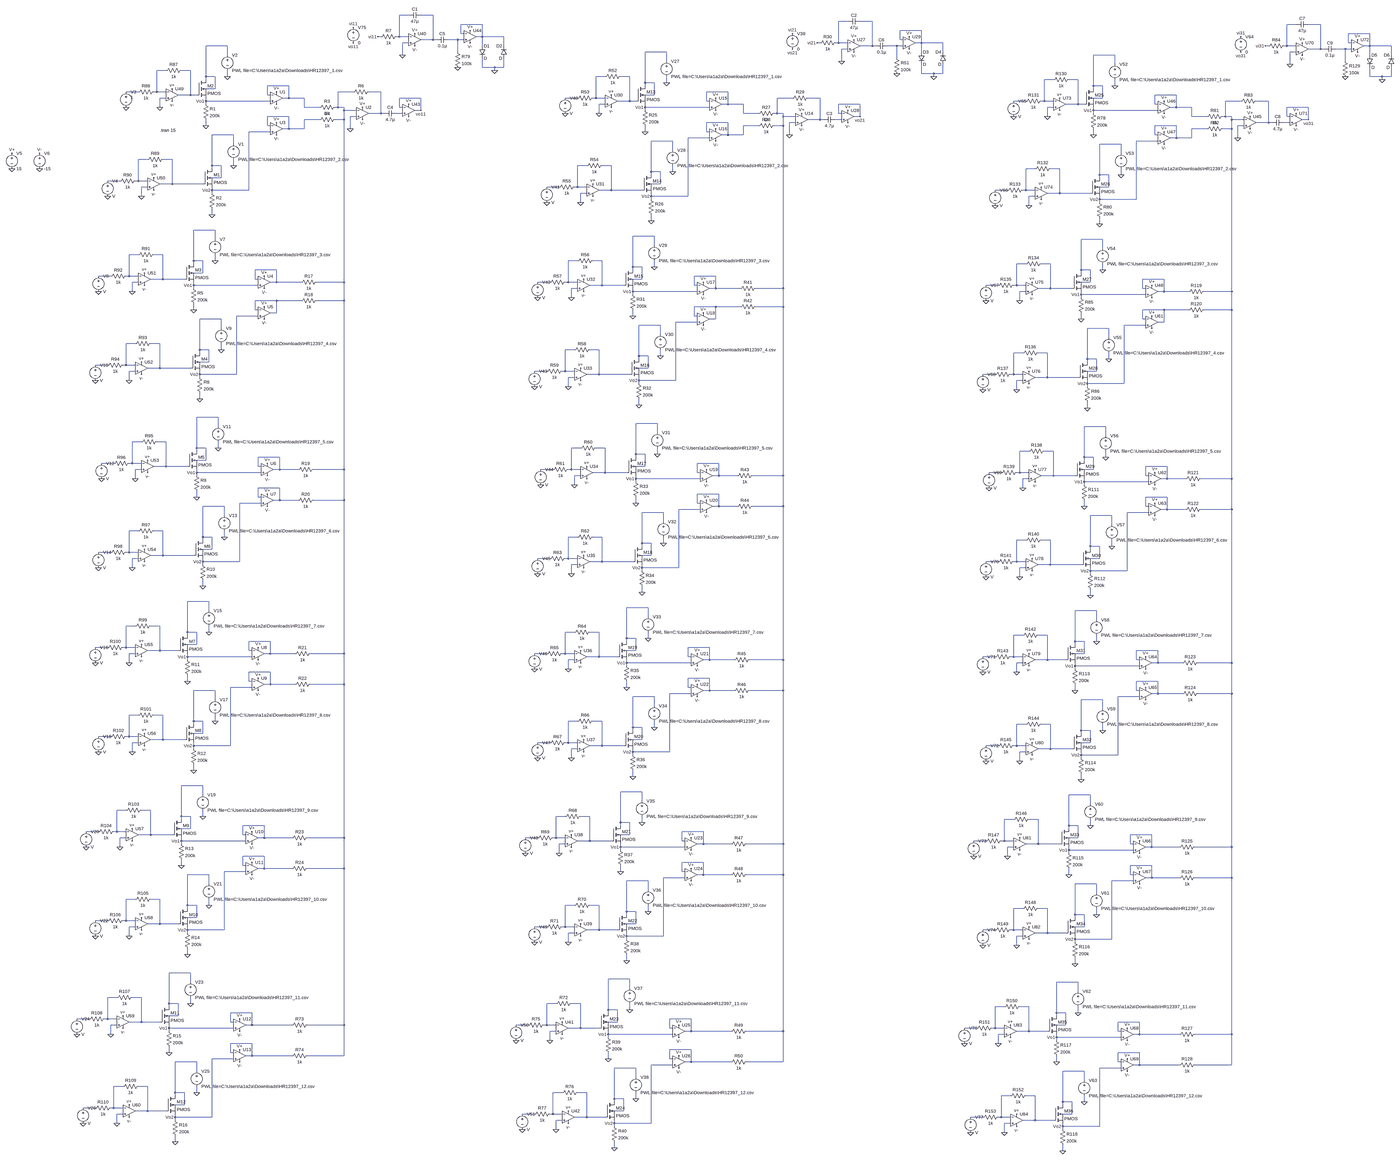
[diagram p0: schematic MASS_Journal_ext_12i3o_36weights_DP.asc, whole sheet]
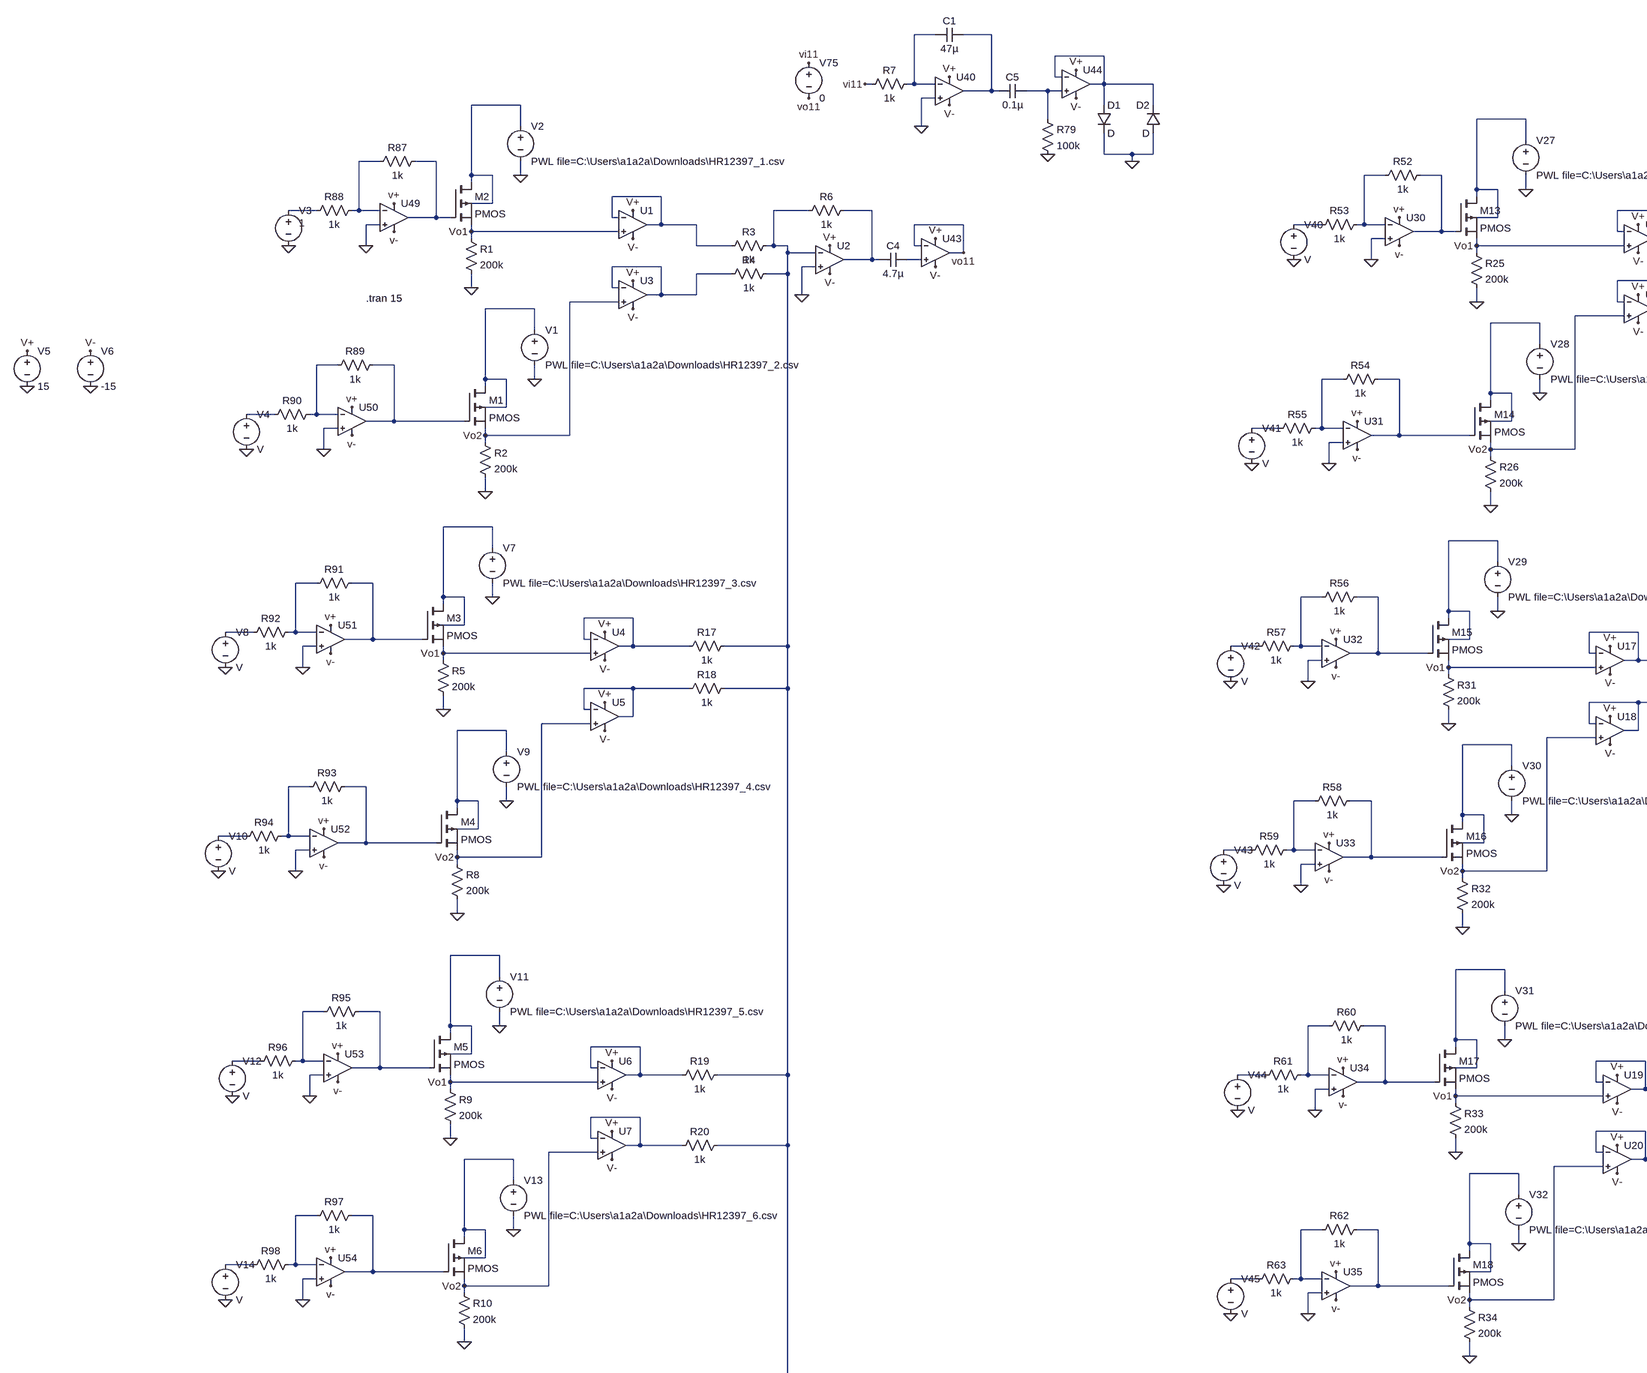
[diagram p1: schematic MASS_Journal_ext_12i3o_36weights_DP.asc, part, row 1 of 2, column 1 of 2]
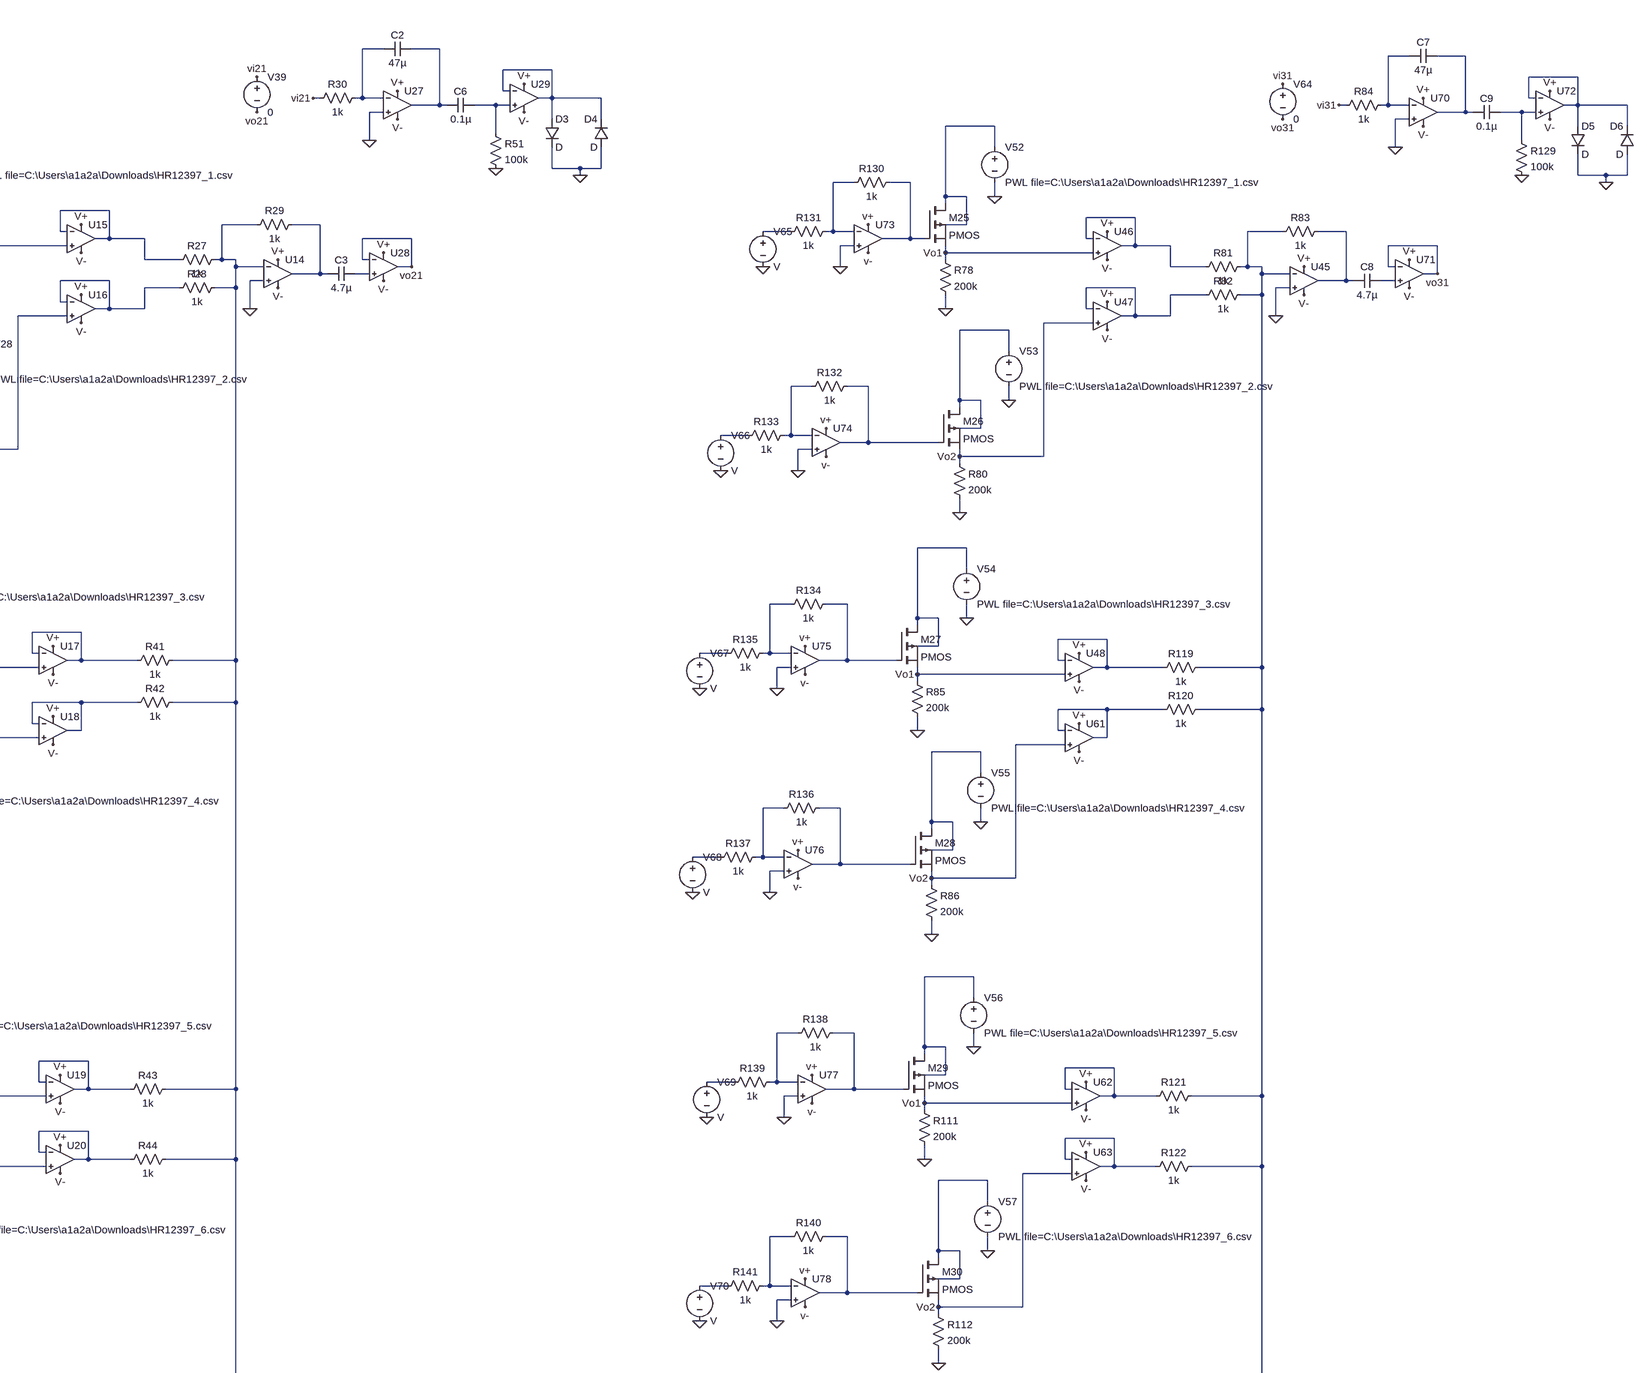
[diagram p2: schematic MASS_Journal_ext_12i3o_36weights_DP.asc, part, row 1 of 2, column 2 of 2]
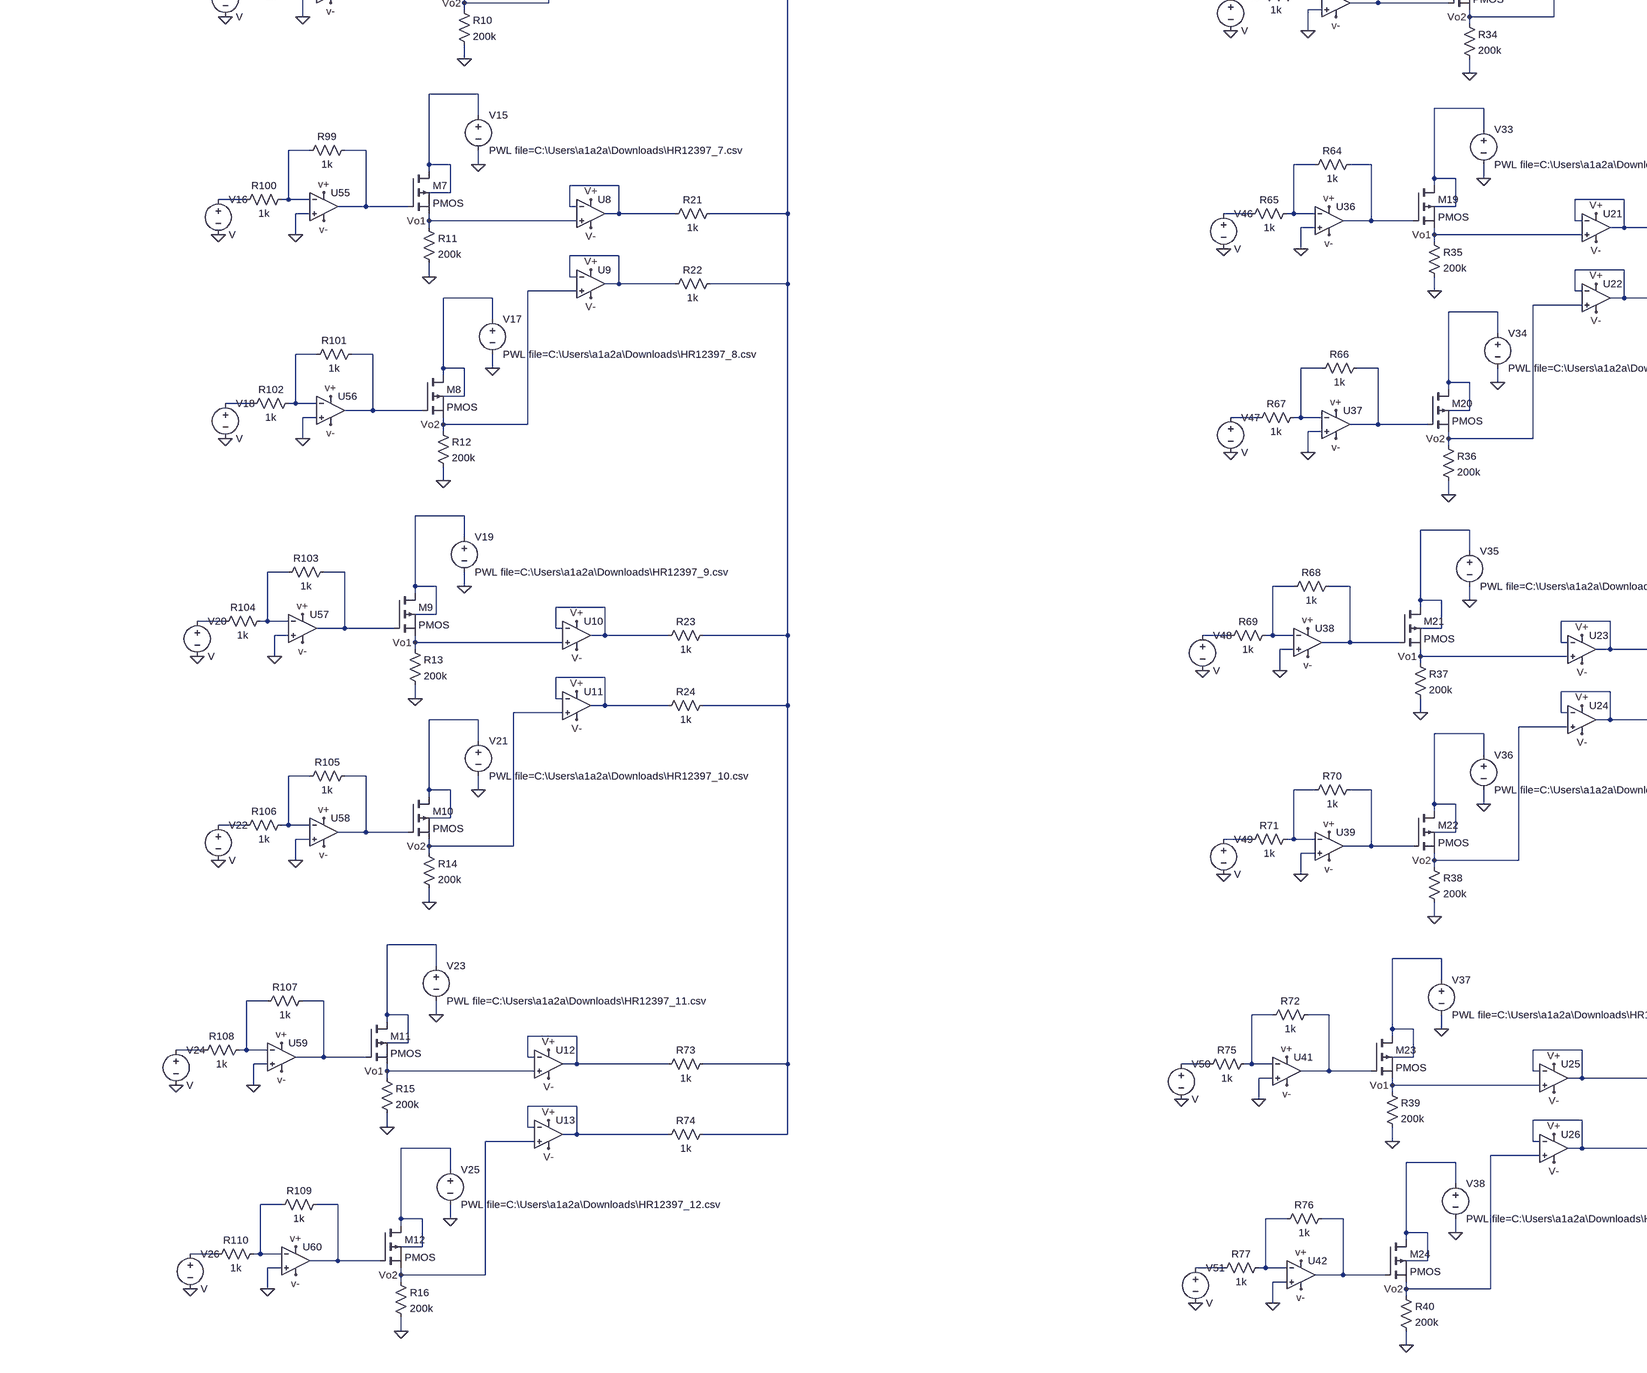
[diagram p3: schematic MASS_Journal_ext_12i3o_36weights_DP.asc, part, row 2 of 2, column 1 of 2]
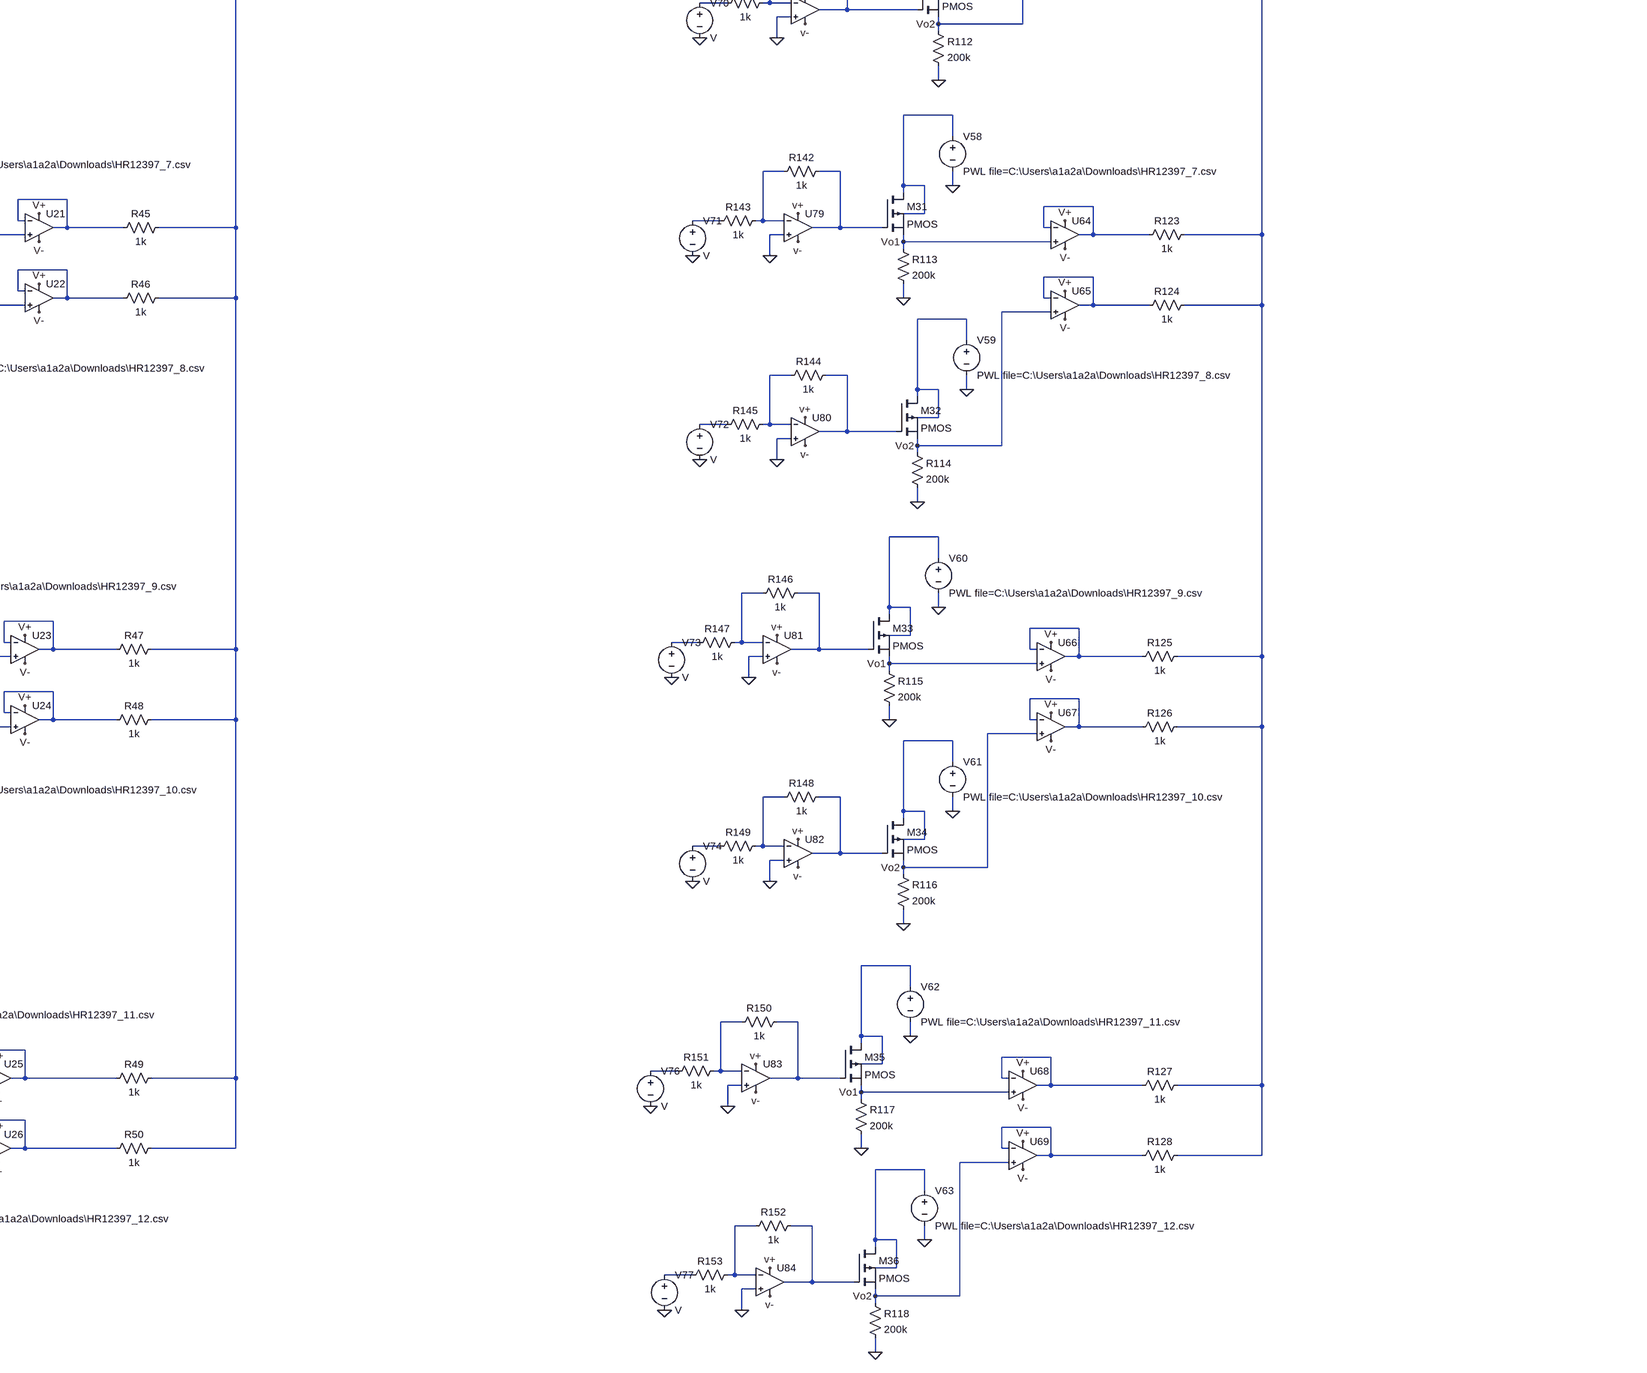
[diagram p4: schematic MASS_Journal_ext_12i3o_36weights_DP.asc, part, row 2 of 2, column 2 of 2]
* MASS_Journal_ext_12i3o_36weights_DP.asc
M2 N011 N017 Vo1 Vo1 PMOS
R1 Vo1 0 200k
V2 N011 0 PWL file=C:\Users\a1a2a\Downloads\HR12397_1.csv
M1 N040 N044 Vo2 Vo2 PMOS
R2 Vo2 0 200k
V1 N040 0 PWL file=C:\Users\a1a2a\Downloads\HR12397_2.csv
R3 N024 N022 1k
R4 N024 N035 1k
R6 N025 N024 1k
R7 N001 vi11 1k
V5 V+ 0 15
V6 V- 0 -15
XU2 0 N024 V+ V- N025 level1 Avol=1Meg GBW=10Meg Vos=0 En=0 Enk=0 In=0 Ink=0 Rin=500Meg  ; pins In+ In- V+ V- OUT
XU1 Vo1 N022 V+ V- N022 level1 Avol=1Meg GBW=10Meg Vos=0 En=0 Enk=0 In=0 Ink=0 Rin=500Meg  ; pins In+ In- V+ V- OUT
XU3 Vo2 N035 V+ V- N035 level1 Avol=1Meg GBW=10Meg Vos=0 En=0 Enk=0 In=0 Ink=0 Rin=500Meg  ; pins In+ In- V+ V- OUT
M3 N052 N056 Vo1 Vo1 PMOS
R5 Vo1 0 200k
V7 N052 0 PWL file=C:\Users\a1a2a\Downloads\HR12397_3.csv
M4 N070 N074 Vo2 Vo2 PMOS
R8 Vo2 0 200k
V9 N070 0 PWL file=C:\Users\a1a2a\Downloads\HR12397_4.csv
XU4 Vo1 N061 V+ V- N061 level1 Avol=1Meg GBW=10Meg Vos=0 En=0 Enk=0 In=0 Ink=0 Rin=500Meg  ; pins In+ In- V+ V- OUT
XU5 Vo2 N067 V+ V- N067 level1 Avol=1Meg GBW=10Meg Vos=0 En=0 Enk=0 In=0 Ink=0 Rin=500Meg  ; pins In+ In- V+ V- OUT
M5 N082 N086 Vo1 Vo1 PMOS
R9 Vo1 0 200k
V11 N082 0 PWL file=C:\Users\a1a2a\Downloads\HR12397_5.csv
M6 N100 N104 Vo2 Vo2 PMOS
R10 Vo2 0 200k
V13 N100 0 PWL file=C:\Users\a1a2a\Downloads\HR12397_6.csv
XU6 Vo1 N091 V+ V- N091 level1 Avol=1Meg GBW=10Meg Vos=0 En=0 Enk=0 In=0 Ink=0 Rin=500Meg  ; pins In+ In- V+ V- OUT
XU7 Vo2 N097 V+ V- N097 level1 Avol=1Meg GBW=10Meg Vos=0 En=0 Enk=0 In=0 Ink=0 Rin=500Meg  ; pins In+ In- V+ V- OUT
M7 N112 N116 Vo1 Vo1 PMOS
R11 Vo1 0 200k
V15 N112 0 PWL file=C:\Users\a1a2a\Downloads\HR12397_7.csv
M8 N130 N134 Vo2 Vo2 PMOS
R12 Vo2 0 200k
V17 N130 0 PWL file=C:\Users\a1a2a\Downloads\HR12397_8.csv
XU8 Vo1 N121 V+ V- N121 level1 Avol=1Meg GBW=10Meg Vos=0 En=0 Enk=0 In=0 Ink=0 Rin=500Meg  ; pins In+ In- V+ V- OUT
XU9 Vo2 N127 V+ V- N127 level1 Avol=1Meg GBW=10Meg Vos=0 En=0 Enk=0 In=0 Ink=0 Rin=500Meg  ; pins In+ In- V+ V- OUT
M9 N142 N146 Vo1 Vo1 PMOS
R13 Vo1 0 200k
V19 N142 0 PWL file=C:\Users\a1a2a\Downloads\HR12397_9.csv
M10 N160 N164 Vo2 Vo2 PMOS
R14 Vo2 0 200k
V21 N160 0 PWL file=C:\Users\a1a2a\Downloads\HR12397_10.csv
XU10 Vo1 N151 V+ V- N151 level1 Avol=1Meg GBW=10Meg Vos=0 En=0 Enk=0 In=0 Ink=0 Rin=500Meg  ; pins In+ In- V+ V- OUT
XU11 Vo2 N157 V+ V- N157 level1 Avol=1Meg GBW=10Meg Vos=0 En=0 Enk=0 In=0 Ink=0 Rin=500Meg  ; pins In+ In- V+ V- OUT
M11 N172 N176 Vo1 Vo1 PMOS
R15 Vo1 0 200k
V23 N172 0 PWL file=C:\Users\a1a2a\Downloads\HR12397_11.csv
M12 N190 N194 Vo2 Vo2 PMOS
R16 Vo2 0 200k
V25 N190 0 PWL file=C:\Users\a1a2a\Downloads\HR12397_12.csv
XU12 Vo1 N181 V+ V- N181 level1 Avol=1Meg GBW=10Meg Vos=0 En=0 Enk=0 In=0 Ink=0 Rin=500Meg  ; pins In+ In- V+ V- OUT
XU13 Vo2 N187 V+ V- N187 level1 Avol=1Meg GBW=10Meg Vos=0 En=0 Enk=0 In=0 Ink=0 Rin=500Meg  ; pins In+ In- V+ V- OUT
R17 N024 N061 1k
R18 N024 N067 1k
R19 N024 N091 1k
R20 N024 N097 1k
R21 N024 N121 1k
R22 N024 N127 1k
R23 N024 N151 1k
R24 N024 N157 1k
R73 N024 N181 1k
R74 N024 N187 1k
C1 N002 N001 47µ
XU40 0 N001 V+ V- N002 level1 Avol=1Meg GBW=10Meg Vos=0 En=0 Enk=0 In=0 Ink=0 Rin=500Meg  ; pins In+ In- V+ V- OUT
C4 N034 N025 4.7µ
V75 vi11 vo11 0
XU43 N034 vo11 V+ V- vo11 level1 Avol=1Meg GBW=10Meg Vos=0 En=0 Enk=0 In=0 Ink=0 Rin=500Meg  ; pins In+ In- V+ V- OUT
C5 N010 N002 0.1µ
R79 N010 0 100k
XU44 N010 N005 V+ V- N005 level1 Avol=1Meg GBW=10Meg Vos=0 En=0 Enk=0 In=0 Ink=0 Rin=500Meg  ; pins In+ In- V+ V- OUT
D1 N005 0 D
D2 0 N005 D
XU49 0 N016 V+ V- N017 level1 Avol=1Meg GBW=10Meg Vos=0 En=0 Enk=0 In=0 Ink=0 Rin=500Meg  ; pins In+ In- V+ V- OUT
R87 N017 N016 1k
R88 N016 N023 1k
V3 N023 0 1
XU50 0 N043 V+ V- N044 level1 Avol=1Meg GBW=10Meg Vos=0 En=0 Enk=0 In=0 Ink=0 Rin=500Meg  ; pins In+ In- V+ V- OUT
R89 N044 N043 1k
R90 N043 N049 1k
V4 N049 0 V
XU51 0 N055 V+ V- N056 level1 Avol=1Meg GBW=10Meg Vos=0 En=0 Enk=0 In=0 Ink=0 Rin=500Meg  ; pins In+ In- V+ V- OUT
R91 N056 N055 1k
R92 N055 N062 1k
V8 N062 0 V
XU52 0 N073 V+ V- N074 level1 Avol=1Meg GBW=10Meg Vos=0 En=0 Enk=0 In=0 Ink=0 Rin=500Meg  ; pins In+ In- V+ V- OUT
R93 N074 N073 1k
R94 N073 N079 1k
V10 N079 0 V
XU53 0 N085 V+ V- N086 level1 Avol=1Meg GBW=10Meg Vos=0 En=0 Enk=0 In=0 Ink=0 Rin=500Meg  ; pins In+ In- V+ V- OUT
R95 N086 N085 1k
R96 N085 N092 1k
V12 N092 0 V
XU54 0 N103 V+ V- N104 level1 Avol=1Meg GBW=10Meg Vos=0 En=0 Enk=0 In=0 Ink=0 Rin=500Meg  ; pins In+ In- V+ V- OUT
R97 N104 N103 1k
R98 N103 N109 1k
V14 N109 0 V
XU55 0 N115 V+ V- N116 level1 Avol=1Meg GBW=10Meg Vos=0 En=0 Enk=0 In=0 Ink=0 Rin=500Meg  ; pins In+ In- V+ V- OUT
R99 N116 N115 1k
R100 N115 N122 1k
V16 N122 0 V
XU56 0 N133 V+ V- N134 level1 Avol=1Meg GBW=10Meg Vos=0 En=0 Enk=0 In=0 Ink=0 Rin=500Meg  ; pins In+ In- V+ V- OUT
R101 N134 N133 1k
R102 N133 N139 1k
V18 N139 0 V
XU57 0 N145 V+ V- N146 level1 Avol=1Meg GBW=10Meg Vos=0 En=0 Enk=0 In=0 Ink=0 Rin=500Meg  ; pins In+ In- V+ V- OUT
R103 N146 N145 1k
R104 N145 N152 1k
V20 N152 0 V
XU58 0 N163 V+ V- N164 level1 Avol=1Meg GBW=10Meg Vos=0 En=0 Enk=0 In=0 Ink=0 Rin=500Meg  ; pins In+ In- V+ V- OUT
R105 N164 N163 1k
R106 N163 N169 1k
V22 N169 0 V
XU59 0 N175 V+ V- N176 level1 Avol=1Meg GBW=10Meg Vos=0 En=0 Enk=0 In=0 Ink=0 Rin=500Meg  ; pins In+ In- V+ V- OUT
R107 N176 N175 1k
R108 N175 N182 1k
V24 N182 0 V
XU60 0 N193 V+ V- N194 level1 Avol=1Meg GBW=10Meg Vos=0 En=0 Enk=0 In=0 Ink=0 Rin=500Meg  ; pins In+ In- V+ V- OUT
R109 N194 N193 1k
R110 N193 N199 1k
V26 N199 0 V
M13 N014 N019 Vo1 Vo1 PMOS
R25 Vo1 0 200k
V27 N014 0 PWL file=C:\Users\a1a2a\Downloads\HR12397_1.csv
M14 N041 N046 Vo2 Vo2 PMOS
R26 Vo2 0 200k
V28 N041 0 PWL file=C:\Users\a1a2a\Downloads\HR12397_2.csv
R27 N029 N026 1k
R28 N029 N037 1k
R29 N030 N029 1k
R30 N003 vi21 1k
XU14 0 N029 V+ V- N030 level1 Avol=1Meg GBW=10Meg Vos=0 En=0 Enk=0 In=0 Ink=0 Rin=500Meg  ; pins In+ In- V+ V- OUT
XU15 Vo1 N026 V+ V- N026 level1 Avol=1Meg GBW=10Meg Vos=0 En=0 Enk=0 In=0 Ink=0 Rin=500Meg  ; pins In+ In- V+ V- OUT
XU16 Vo2 N037 V+ V- N037 level1 Avol=1Meg GBW=10Meg Vos=0 En=0 Enk=0 In=0 Ink=0 Rin=500Meg  ; pins In+ In- V+ V- OUT
M15 N053 N058 Vo1 Vo1 PMOS
R31 Vo1 0 200k
V29 N053 0 PWL file=C:\Users\a1a2a\Downloads\HR12397_3.csv
M16 N071 N076 Vo2 Vo2 PMOS
R32 Vo2 0 200k
V30 N071 0 PWL file=C:\Users\a1a2a\Downloads\HR12397_4.csv
XU17 Vo1 N063 V+ V- N063 level1 Avol=1Meg GBW=10Meg Vos=0 En=0 Enk=0 In=0 Ink=0 Rin=500Meg  ; pins In+ In- V+ V- OUT
XU18 Vo2 N068 V+ V- N068 level1 Avol=1Meg GBW=10Meg Vos=0 En=0 Enk=0 In=0 Ink=0 Rin=500Meg  ; pins In+ In- V+ V- OUT
M17 N083 N088 Vo1 Vo1 PMOS
R33 Vo1 0 200k
V31 N083 0 PWL file=C:\Users\a1a2a\Downloads\HR12397_5.csv
M18 N101 N106 Vo2 Vo2 PMOS
R34 Vo2 0 200k
V32 N101 0 PWL file=C:\Users\a1a2a\Downloads\HR12397_6.csv
XU19 Vo1 N093 V+ V- N093 level1 Avol=1Meg GBW=10Meg Vos=0 En=0 Enk=0 In=0 Ink=0 Rin=500Meg  ; pins In+ In- V+ V- OUT
XU20 Vo2 N098 V+ V- N098 level1 Avol=1Meg GBW=10Meg Vos=0 En=0 Enk=0 In=0 Ink=0 Rin=500Meg  ; pins In+ In- V+ V- OUT
M19 N113 N118 Vo1 Vo1 PMOS
R35 Vo1 0 200k
V33 N113 0 PWL file=C:\Users\a1a2a\Downloads\HR12397_7.csv
M20 N131 N136 Vo2 Vo2 PMOS
R36 Vo2 0 200k
V34 N131 0 PWL file=C:\Users\a1a2a\Downloads\HR12397_8.csv
XU21 Vo1 N123 V+ V- N123 level1 Avol=1Meg GBW=10Meg Vos=0 En=0 Enk=0 In=0 Ink=0 Rin=500Meg  ; pins In+ In- V+ V- OUT
XU22 Vo2 N128 V+ V- N128 level1 Avol=1Meg GBW=10Meg Vos=0 En=0 Enk=0 In=0 Ink=0 Rin=500Meg  ; pins In+ In- V+ V- OUT
M21 N143 N148 Vo1 Vo1 PMOS
R37 Vo1 0 200k
V35 N143 0 PWL file=C:\Users\a1a2a\Downloads\HR12397_9.csv
M22 N161 N166 Vo2 Vo2 PMOS
R38 Vo2 0 200k
V36 N161 0 PWL file=C:\Users\a1a2a\Downloads\HR12397_10.csv
XU23 Vo1 N153 V+ V- N153 level1 Avol=1Meg GBW=10Meg Vos=0 En=0 Enk=0 In=0 Ink=0 Rin=500Meg  ; pins In+ In- V+ V- OUT
XU24 Vo2 N158 V+ V- N158 level1 Avol=1Meg GBW=10Meg Vos=0 En=0 Enk=0 In=0 Ink=0 Rin=500Meg  ; pins In+ In- V+ V- OUT
M23 N173 N178 Vo1 Vo1 PMOS
R39 Vo1 0 200k
V37 N173 0 PWL file=C:\Users\a1a2a\Downloads\HR12397_11.csv
M24 N191 N196 Vo2 Vo2 PMOS
R40 Vo2 0 200k
V38 N191 0 PWL file=C:\Users\a1a2a\Downloads\HR12397_12.csv
XU25 Vo1 N183 V+ V- N183 level1 Avol=1Meg GBW=10Meg Vos=0 En=0 Enk=0 In=0 Ink=0 Rin=500Meg  ; pins In+ In- V+ V- OUT
XU26 Vo2 N188 V+ V- N188 level1 Avol=1Meg GBW=10Meg Vos=0 En=0 Enk=0 In=0 Ink=0 Rin=500Meg  ; pins In+ In- V+ V- OUT
R41 N029 N063 1k
R42 N029 N068 1k
R43 N029 N093 1k
R44 N029 N098 1k
R45 N029 N123 1k
R46 N029 N128 1k
R47 N029 N153 1k
R48 N029 N158 1k
R49 N029 N183 1k
R50 N029 N188 1k
C2 N004 N003 47µ
XU27 0 N003 V+ V- N004 level1 Avol=1Meg GBW=10Meg Vos=0 En=0 Enk=0 In=0 Ink=0 Rin=500Meg  ; pins In+ In- V+ V- OUT
C3 N036 N030 4.7µ
V39 vi21 vo21 0
XU28 N036 vo21 V+ V- vo21 level1 Avol=1Meg GBW=10Meg Vos=0 En=0 Enk=0 In=0 Ink=0 Rin=500Meg  ; pins In+ In- V+ V- OUT
C6 N012 N004 0.1µ
R51 N012 0 100k
XU29 N012 N008 V+ V- N008 level1 Avol=1Meg GBW=10Meg Vos=0 En=0 Enk=0 In=0 Ink=0 Rin=500Meg  ; pins In+ In- V+ V- OUT
D3 N008 0 D
D4 0 N008 D
XU30 0 N018 V+ V- N019 level1 Avol=1Meg GBW=10Meg Vos=0 En=0 Enk=0 In=0 Ink=0 Rin=500Meg  ; pins In+ In- V+ V- OUT
R52 N019 N018 1k
R53 N018 N028 1k
V40 N028 0 V
XU31 0 N045 V+ V- N046 level1 Avol=1Meg GBW=10Meg Vos=0 En=0 Enk=0 In=0 Ink=0 Rin=500Meg  ; pins In+ In- V+ V- OUT
R54 N046 N045 1k
R55 N045 N050 1k
V41 N050 0 V
XU32 0 N057 V+ V- N058 level1 Avol=1Meg GBW=10Meg Vos=0 En=0 Enk=0 In=0 Ink=0 Rin=500Meg  ; pins In+ In- V+ V- OUT
R56 N058 N057 1k
R57 N057 N065 1k
V42 N065 0 V
XU33 0 N075 V+ V- N076 level1 Avol=1Meg GBW=10Meg Vos=0 En=0 Enk=0 In=0 Ink=0 Rin=500Meg  ; pins In+ In- V+ V- OUT
R58 N076 N075 1k
R59 N075 N080 1k
V43 N080 0 V
XU34 0 N087 V+ V- N088 level1 Avol=1Meg GBW=10Meg Vos=0 En=0 Enk=0 In=0 Ink=0 Rin=500Meg  ; pins In+ In- V+ V- OUT
R60 N088 N087 1k
R61 N087 N095 1k
V44 N095 0 V
XU35 0 N105 V+ V- N106 level1 Avol=1Meg GBW=10Meg Vos=0 En=0 Enk=0 In=0 Ink=0 Rin=500Meg  ; pins In+ In- V+ V- OUT
R62 N106 N105 1k
R63 N105 N110 1k
V45 N110 0 V
XU36 0 N117 V+ V- N118 level1 Avol=1Meg GBW=10Meg Vos=0 En=0 Enk=0 In=0 Ink=0 Rin=500Meg  ; pins In+ In- V+ V- OUT
R64 N118 N117 1k
R65 N117 N125 1k
V46 N125 0 V
XU37 0 N135 V+ V- N136 level1 Avol=1Meg GBW=10Meg Vos=0 En=0 Enk=0 In=0 Ink=0 Rin=500Meg  ; pins In+ In- V+ V- OUT
R66 N136 N135 1k
R67 N135 N140 1k
V47 N140 0 V
XU38 0 N147 V+ V- N148 level1 Avol=1Meg GBW=10Meg Vos=0 En=0 Enk=0 In=0 Ink=0 Rin=500Meg  ; pins In+ In- V+ V- OUT
R68 N148 N147 1k
R69 N147 N155 1k
V48 N155 0 V
XU39 0 N165 V+ V- N166 level1 Avol=1Meg GBW=10Meg Vos=0 En=0 Enk=0 In=0 Ink=0 Rin=500Meg  ; pins In+ In- V+ V- OUT
R70 N166 N165 1k
R71 N165 N170 1k
V49 N170 0 V
XU41 0 N177 V+ V- N178 level1 Avol=1Meg GBW=10Meg Vos=0 En=0 Enk=0 In=0 Ink=0 Rin=500Meg  ; pins In+ In- V+ V- OUT
R72 N178 N177 1k
R75 N177 N185 1k
V50 N185 0 V
XU42 0 N195 V+ V- N196 level1 Avol=1Meg GBW=10Meg Vos=0 En=0 Enk=0 In=0 Ink=0 Rin=500Meg  ; pins In+ In- V+ V- OUT
R76 N196 N195 1k
R77 N195 N200 1k
V51 N200 0 V
M25 N015 N021 Vo1 Vo1 PMOS
R78 Vo1 0 200k
V52 N015 0 PWL file=C:\Users\a1a2a\Downloads\HR12397_1.csv
M26 N042 N048 Vo2 Vo2 PMOS
R80 Vo2 0 200k
V53 N042 0 PWL file=C:\Users\a1a2a\Downloads\HR12397_2.csv
R81 N032 N027 1k
R82 N032 N039 1k
R83 N033 N032 1k
R84 N006 vi31 1k
XU45 0 N032 V+ V- N033 level1 Avol=1Meg GBW=10Meg Vos=0 En=0 Enk=0 In=0 Ink=0 Rin=500Meg  ; pins In+ In- V+ V- OUT
XU46 Vo1 N027 V+ V- N027 level1 Avol=1Meg GBW=10Meg Vos=0 En=0 Enk=0 In=0 Ink=0 Rin=500Meg  ; pins In+ In- V+ V- OUT
XU47 Vo2 N039 V+ V- N039 level1 Avol=1Meg GBW=10Meg Vos=0 En=0 Enk=0 In=0 Ink=0 Rin=500Meg  ; pins In+ In- V+ V- OUT
M27 N054 N060 Vo1 Vo1 PMOS
R85 Vo1 0 200k
V54 N054 0 PWL file=C:\Users\a1a2a\Downloads\HR12397_3.csv
M28 N072 N078 Vo2 Vo2 PMOS
R86 Vo2 0 200k
V55 N072 0 PWL file=C:\Users\a1a2a\Downloads\HR12397_4.csv
XU48 Vo1 N064 V+ V- N064 level1 Avol=1Meg GBW=10Meg Vos=0 En=0 Enk=0 In=0 Ink=0 Rin=500Meg  ; pins In+ In- V+ V- OUT
XU61 Vo2 N069 V+ V- N069 level1 Avol=1Meg GBW=10Meg Vos=0 En=0 Enk=0 In=0 Ink=0 Rin=500Meg  ; pins In+ In- V+ V- OUT
M29 N084 N090 Vo1 Vo1 PMOS
R111 Vo1 0 200k
V56 N084 0 PWL file=C:\Users\a1a2a\Downloads\HR12397_5.csv
M30 N102 N108 Vo2 Vo2 PMOS
R112 Vo2 0 200k
V57 N102 0 PWL file=C:\Users\a1a2a\Downloads\HR12397_6.csv
XU62 Vo1 N094 V+ V- N094 level1 Avol=1Meg GBW=10Meg Vos=0 En=0 Enk=0 In=0 Ink=0 Rin=500Meg  ; pins In+ In- V+ V- OUT
XU63 Vo2 N099 V+ V- N099 level1 Avol=1Meg GBW=10Meg Vos=0 En=0 Enk=0 In=0 Ink=0 Rin=500Meg  ; pins In+ In- V+ V- OUT
M31 N114 N120 Vo1 Vo1 PMOS
R113 Vo1 0 200k
V58 N114 0 PWL file=C:\Users\a1a2a\Downloads\HR12397_7.csv
M32 N132 N138 Vo2 Vo2 PMOS
R114 Vo2 0 200k
V59 N132 0 PWL file=C:\Users\a1a2a\Downloads\HR12397_8.csv
XU64 Vo1 N124 V+ V- N124 level1 Avol=1Meg GBW=10Meg Vos=0 En=0 Enk=0 In=0 Ink=0 Rin=500Meg  ; pins In+ In- V+ V- OUT
XU65 Vo2 N129 V+ V- N129 level1 Avol=1Meg GBW=10Meg Vos=0 En=0 Enk=0 In=0 Ink=0 Rin=500Meg  ; pins In+ In- V+ V- OUT
M33 N144 N150 Vo1 Vo1 PMOS
R115 Vo1 0 200k
V60 N144 0 PWL file=C:\Users\a1a2a\Downloads\HR12397_9.csv
M34 N162 N168 Vo2 Vo2 PMOS
R116 Vo2 0 200k
V61 N162 0 PWL file=C:\Users\a1a2a\Downloads\HR12397_10.csv
XU66 Vo1 N154 V+ V- N154 level1 Avol=1Meg GBW=10Meg Vos=0 En=0 Enk=0 In=0 Ink=0 Rin=500Meg  ; pins In+ In- V+ V- OUT
XU67 Vo2 N159 V+ V- N159 level1 Avol=1Meg GBW=10Meg Vos=0 En=0 Enk=0 In=0 Ink=0 Rin=500Meg  ; pins In+ In- V+ V- OUT
M35 N174 N180 Vo1 Vo1 PMOS
R117 Vo1 0 200k
V62 N174 0 PWL file=C:\Users\a1a2a\Downloads\HR12397_11.csv
M36 N192 N198 Vo2 Vo2 PMOS
R118 Vo2 0 200k
V63 N192 0 PWL file=C:\Users\a1a2a\Downloads\HR12397_12.csv
XU68 Vo1 N184 V+ V- N184 level1 Avol=1Meg GBW=10Meg Vos=0 En=0 Enk=0 In=0 Ink=0 Rin=500Meg  ; pins In+ In- V+ V- OUT
XU69 Vo2 N189 V+ V- N189 level1 Avol=1Meg GBW=10Meg Vos=0 En=0 Enk=0 In=0 Ink=0 Rin=500Meg  ; pins In+ In- V+ V- OUT
R119 N032 N064 1k
R120 N032 N069 1k
R121 N032 N094 1k
R122 N032 N099 1k
R123 N032 N124 1k
R124 N032 N129 1k
R125 N032 N154 1k
R126 N032 N159 1k
R127 N032 N184 1k
R128 N032 N189 1k
C7 N007 N006 47µ
XU70 0 N006 V+ V- N007 level1 Avol=1Meg GBW=10Meg Vos=0 En=0 Enk=0 In=0 Ink=0 Rin=500Meg  ; pins In+ In- V+ V- OUT
C8 N038 N033 4.7µ
V64 vi31 vo31 0
XU71 N038 vo31 V+ V- vo31 level1 Avol=1Meg GBW=10Meg Vos=0 En=0 Enk=0 In=0 Ink=0 Rin=500Meg  ; pins In+ In- V+ V- OUT
C9 N013 N007 0.1µ
R129 N013 0 100k
XU72 N013 N009 V+ V- N009 level1 Avol=1Meg GBW=10Meg Vos=0 En=0 Enk=0 In=0 Ink=0 Rin=500Meg  ; pins In+ In- V+ V- OUT
D5 N009 0 D
D6 0 N009 D
XU73 0 N020 V+ V- N021 level1 Avol=1Meg GBW=10Meg Vos=0 En=0 Enk=0 In=0 Ink=0 Rin=500Meg  ; pins In+ In- V+ V- OUT
R130 N021 N020 1k
R131 N020 N031 1k
V65 N031 0 V
XU74 0 N047 V+ V- N048 level1 Avol=1Meg GBW=10Meg Vos=0 En=0 Enk=0 In=0 Ink=0 Rin=500Meg  ; pins In+ In- V+ V- OUT
R132 N048 N047 1k
R133 N047 N051 1k
V66 N051 0 V
XU75 0 N059 V+ V- N060 level1 Avol=1Meg GBW=10Meg Vos=0 En=0 Enk=0 In=0 Ink=0 Rin=500Meg  ; pins In+ In- V+ V- OUT
R134 N060 N059 1k
R135 N059 N066 1k
V67 N066 0 V
XU76 0 N077 V+ V- N078 level1 Avol=1Meg GBW=10Meg Vos=0 En=0 Enk=0 In=0 Ink=0 Rin=500Meg  ; pins In+ In- V+ V- OUT
R136 N078 N077 1k
R137 N077 N081 1k
V68 N081 0 V
XU77 0 N089 V+ V- N090 level1 Avol=1Meg GBW=10Meg Vos=0 En=0 Enk=0 In=0 Ink=0 Rin=500Meg  ; pins In+ In- V+ V- OUT
R138 N090 N089 1k
R139 N089 N096 1k
V69 N096 0 V
XU78 0 N107 V+ V- N108 level1 Avol=1Meg GBW=10Meg Vos=0 En=0 Enk=0 In=0 Ink=0 Rin=500Meg  ; pins In+ In- V+ V- OUT
R140 N108 N107 1k
R141 N107 N111 1k
V70 N111 0 V
XU79 0 N119 V+ V- N120 level1 Avol=1Meg GBW=10Meg Vos=0 En=0 Enk=0 In=0 Ink=0 Rin=500Meg  ; pins In+ In- V+ V- OUT
R142 N120 N119 1k
R143 N119 N126 1k
V71 N126 0 V
XU80 0 N137 V+ V- N138 level1 Avol=1Meg GBW=10Meg Vos=0 En=0 Enk=0 In=0 Ink=0 Rin=500Meg  ; pins In+ In- V+ V- OUT
R144 N138 N137 1k
R145 N137 N141 1k
V72 N141 0 V
XU81 0 N149 V+ V- N150 level1 Avol=1Meg GBW=10Meg Vos=0 En=0 Enk=0 In=0 Ink=0 Rin=500Meg  ; pins In+ In- V+ V- OUT
R146 N150 N149 1k
R147 N149 N156 1k
V73 N156 0 V
XU82 0 N167 V+ V- N168 level1 Avol=1Meg GBW=10Meg Vos=0 En=0 Enk=0 In=0 Ink=0 Rin=500Meg  ; pins In+ In- V+ V- OUT
R148 N168 N167 1k
R149 N167 N171 1k
V74 N171 0 V
XU83 0 N179 V+ V- N180 level1 Avol=1Meg GBW=10Meg Vos=0 En=0 Enk=0 In=0 Ink=0 Rin=500Meg  ; pins In+ In- V+ V- OUT
R150 N180 N179 1k
R151 N179 N186 1k
V76 N186 0 V
XU84 0 N197 V+ V- N198 level1 Avol=1Meg GBW=10Meg Vos=0 En=0 Enk=0 In=0 Ink=0 Rin=500Meg  ; pins In+ In- V+ V- OUT
R152 N198 N197 1k
R153 N197 N201 1k
V77 N201 0 V
.model D D
.lib standard.dio
.model NMOS NMOS
.model PMOS PMOS
.lib standard.mos
.tran 15
.lib UniversalOpAmp1.lib
.backanno
.end